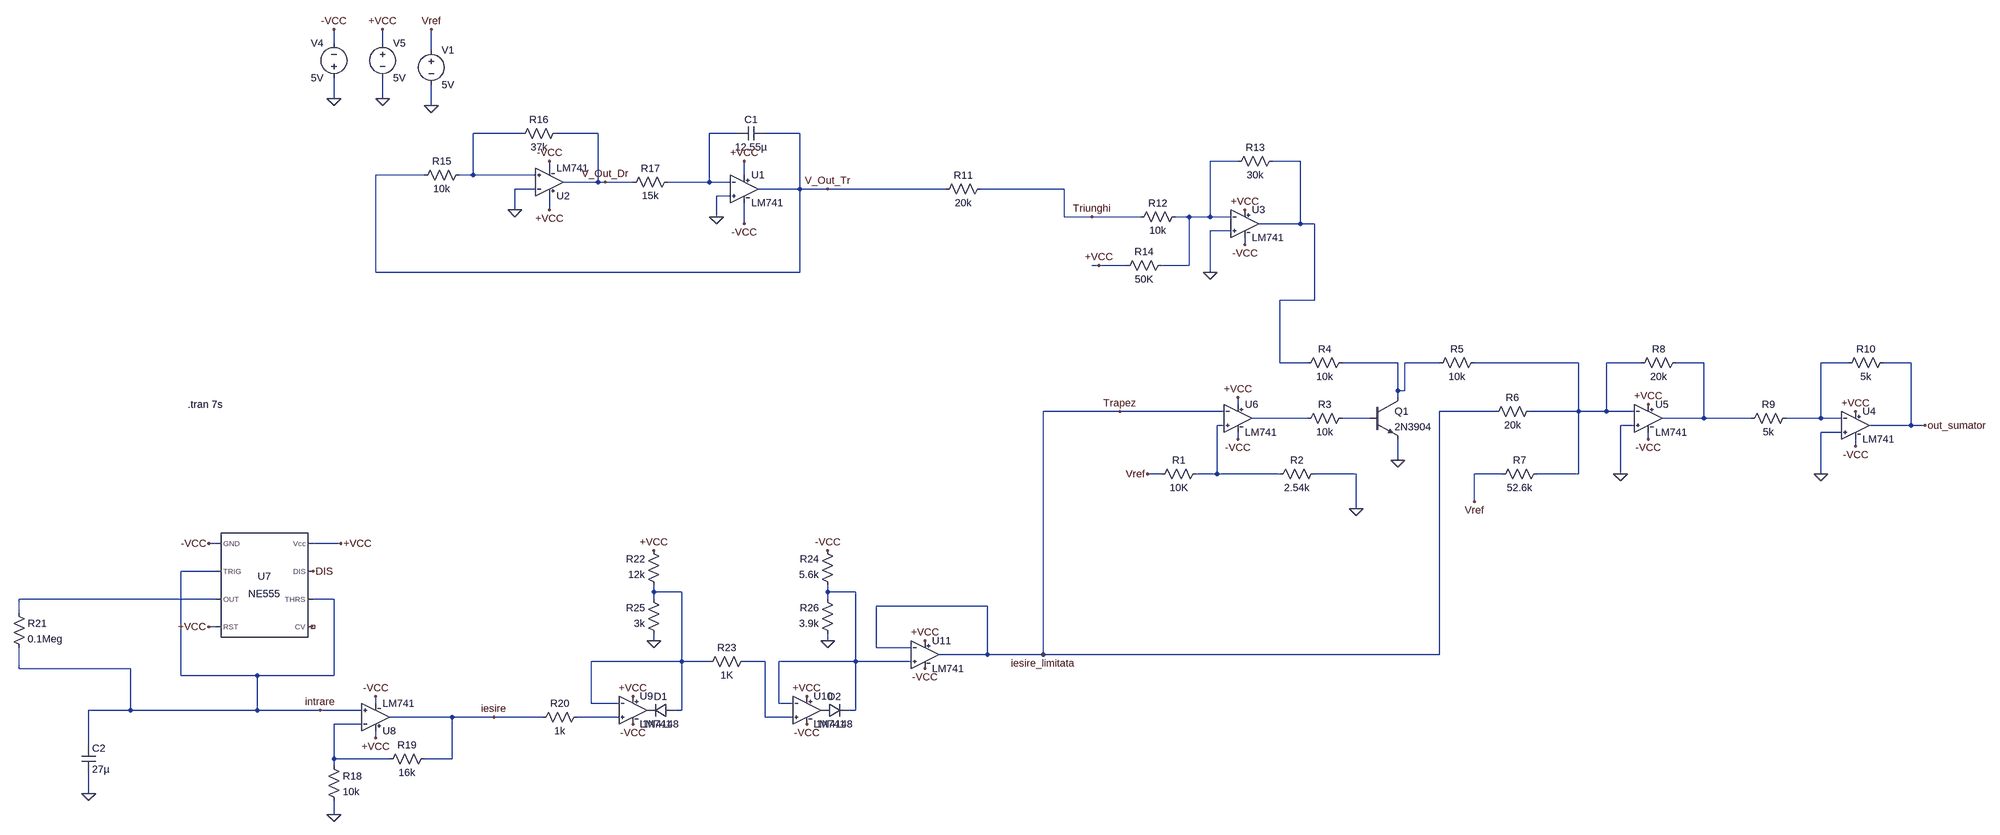
[diagram p0: schematic ProiectSCIAIII_MoldovanBianca_Grupa2231.asc]
ProiectSCIAIII_MoldovanBianca_Grupa2231.asc, the LTspice schematic file:
Version 4.1
SHEET 1 2696 1428
WIRE -2608 -624 -2608 -656
WIRE -2496 -624 -2496 -656
WIRE -2384 -608 -2384 -656
WIRE -2608 -496 -2608 -544
WIRE -2496 -496 -2496 -544
WIRE -2384 -480 -2384 -528
WIRE -2176 -416 -2288 -416
WIRE -2000 -416 -2096 -416
WIRE -1680 -416 -1744 -416
WIRE -1536 -416 -1616 -416
WIRE -528 -352 -592 -352
WIRE -384 -352 -448 -352
WIRE -2112 -336 -2112 -352
WIRE -2400 -320 -2512 -320
WIRE -2288 -320 -2288 -416
WIRE -2288 -320 -2320 -320
WIRE -2144 -320 -2288 -320
WIRE -1664 -320 -1664 -352
WIRE -2000 -304 -2000 -416
WIRE -2000 -304 -2080 -304
WIRE -1984 -304 -2000 -304
WIRE -1920 -304 -1984 -304
WIRE -1744 -304 -1744 -416
WIRE -1744 -304 -1840 -304
WIRE -1696 -304 -1744 -304
WIRE -2144 -288 -2192 -288
WIRE -1536 -288 -1536 -416
WIRE -1536 -288 -1632 -288
WIRE -1472 -288 -1536 -288
WIRE -1200 -288 -1472 -288
WIRE -928 -288 -1120 -288
WIRE -1696 -272 -1728 -272
WIRE -2192 -240 -2192 -288
WIRE -2112 -240 -2112 -272
WIRE -1728 -224 -1728 -272
WIRE -928 -224 -928 -288
WIRE -864 -224 -928 -224
WIRE -752 -224 -864 -224
WIRE -640 -224 -672 -224
WIRE -592 -224 -592 -352
WIRE -592 -224 -640 -224
WIRE -544 -224 -592 -224
WIRE -1664 -208 -1664 -256
WIRE -384 -208 -384 -352
WIRE -384 -208 -480 -208
WIRE -352 -208 -384 -208
WIRE -544 -192 -592 -192
WIRE -512 -160 -512 -176
WIRE -848 -112 -864 -112
WIRE -784 -112 -848 -112
WIRE -640 -112 -640 -224
WIRE -640 -112 -704 -112
WIRE -2512 -96 -2512 -320
WIRE -1536 -96 -1536 -288
WIRE -1536 -96 -2512 -96
WIRE -592 -96 -592 -192
WIRE -352 -32 -352 -208
WIRE -352 -32 -432 -32
WIRE -432 112 -432 -32
WIRE -368 112 -432 112
WIRE -160 112 -288 112
WIRE -64 112 -144 112
WIRE 256 112 16 112
WIRE 400 112 320 112
WIRE 544 112 480 112
WIRE 992 112 928 112
WIRE 1136 112 1072 112
WIRE -160 176 -160 112
WIRE -144 176 -144 112
WIRE -144 176 -160 176
WIRE -160 192 -160 176
WIRE -528 208 -528 192
WIRE -800 224 -976 224
WIRE -560 224 -800 224
WIRE 64 224 -64 224
WIRE 256 224 256 112
WIRE 256 224 144 224
WIRE 320 224 320 112
WIRE 320 224 256 224
WIRE 384 224 320 224
WIRE -368 240 -496 240
WIRE -224 240 -288 240
WIRE 544 240 544 112
WIRE 544 240 448 240
WIRE 768 240 544 240
WIRE 928 240 928 112
WIRE 928 240 848 240
WIRE 976 240 928 240
WIRE -560 256 -576 256
WIRE 384 256 352 256
WIRE 1136 256 1136 112
WIRE 1136 256 1040 256
WIRE 1168 256 1136 256
WIRE 976 272 928 272
WIRE -528 288 -528 272
WIRE 416 288 416 272
WIRE 1008 304 1008 288
WIRE -160 336 -160 288
WIRE -704 368 -736 368
WIRE -576 368 -576 256
WIRE -576 368 -624 368
WIRE -432 368 -576 368
WIRE -256 368 -352 368
WIRE 80 368 16 368
WIRE 256 368 256 224
WIRE 256 368 160 368
WIRE 352 368 352 256
WIRE 928 368 928 272
WIRE 16 432 16 368
WIRE -256 448 -256 368
WIRE -2880 528 -2896 528
WIRE -2592 528 -2656 528
WIRE -2880 592 -2960 592
WIRE -1872 640 -1872 624
WIRE -1808 640 -1872 640
WIRE -1472 640 -1472 624
WIRE -1408 640 -1472 640
WIRE -2880 656 -3344 656
WIRE -2608 656 -2656 656
WIRE -1872 656 -1872 640
WIRE -1472 656 -1472 640
WIRE -1104 672 -1360 672
WIRE -3344 688 -3344 656
WIRE -2880 720 -2896 720
WIRE -1872 752 -1872 736
WIRE -1472 752 -1472 736
WIRE -1360 768 -1360 672
WIRE -1280 768 -1360 768
WIRE -1104 784 -1104 672
WIRE -1104 784 -1216 784
WIRE -976 784 -976 224
WIRE -976 784 -1104 784
WIRE -64 784 -64 224
WIRE -64 784 -976 784
WIRE -1808 800 -1808 640
WIRE -1808 800 -2016 800
WIRE -1744 800 -1808 800
WIRE -1616 800 -1664 800
WIRE -1408 800 -1408 640
WIRE -1408 800 -1584 800
WIRE -1280 800 -1408 800
WIRE -3344 816 -3344 768
WIRE -3088 816 -3344 816
WIRE -2960 832 -2960 592
WIRE -2784 832 -2960 832
WIRE -2608 832 -2608 656
WIRE -2608 832 -2784 832
WIRE -2512 896 -2512 880
WIRE -2016 896 -2016 800
WIRE -1952 896 -2016 896
WIRE -1584 896 -1584 800
WIRE -1552 896 -1584 896
WIRE -3088 912 -3088 816
WIRE -3088 912 -3184 912
WIRE -2784 912 -2784 832
WIRE -2784 912 -3088 912
WIRE -2640 912 -2784 912
WIRE -2544 912 -2640 912
WIRE -1808 912 -1808 800
WIRE -1808 912 -1824 912
WIRE -1408 912 -1408 800
WIRE -1408 912 -1424 912
WIRE -2336 928 -2480 928
WIRE -2240 928 -2336 928
WIRE -2128 928 -2240 928
WIRE -1952 928 -2048 928
WIRE -1616 928 -1616 800
WIRE -1552 928 -1616 928
WIRE -2544 944 -2608 944
WIRE -2512 976 -2512 960
WIRE -3184 992 -3184 912
WIRE -2608 1024 -2608 944
WIRE -2480 1024 -2608 1024
WIRE -2336 1024 -2336 928
WIRE -2336 1024 -2400 1024
WIRE -2608 1040 -2608 1024
WIRE -3184 1104 -3184 1056
WIRE -2608 1152 -2608 1120
FLAG -256 448 0
FLAG -160 336 0
FLAG -528 192 +VCC
FLAG -528 288 -VCC
FLAG 352 368 0
FLAG 928 368 0
FLAG 416 288 -VCC
FLAG 416 208 +VCC
FLAG 1008 224 +VCC
FLAG 1008 304 -VCC
FLAG -736 368 Vref
FLAG -2384 -656 Vref
FLAG -2384 -480 0
FLAG -2608 -496 0
FLAG -2608 -656 -VCC
FLAG -2496 -496 0
FLAG -2496 -656 +VCC
FLAG -800 224 Trapez
FLAG 1168 256 out_sumator
FLAG -592 -96 0
FLAG -512 -240 +VCC
FLAG -512 -160 -VCC
FLAG -848 -112 +VCC
FLAG -2192 -240 0
FLAG -1728 -224 0
FLAG -2112 -240 +VCC
FLAG -2112 -352 -VCC
FLAG -1472 -288 V_Out_Tr
FLAG -1984 -304 V_Out_Dr
FLAG -1664 -208 -VCC
FLAG -1664 -352 +VCC
FLAG -2896 528 -VCC
FLAG -2896 720 +VCC
FLAG -3184 1104 0
FLAG -2592 528 +VCC
FLAG -976 784 iesire_limitata
FLAG -2512 880 -VCC
FLAG -2512 976 +VCC
FLAG -2640 912 intrare
FLAG -2608 1152 0
FLAG -864 -224 Triunghi
FLAG 16 432 Vref
FLAG -1920 880 +VCC
FLAG -1920 944 -VCC
FLAG -1520 880 +VCC
FLAG -1520 944 -VCC
FLAG -1872 752 0
FLAG -1872 544 +VCC
FLAG -1472 752 0
FLAG -1472 544 -VCC
FLAG -2240 928 iesire
FLAG -1248 752 +VCC
FLAG -1248 816 -VCC
FLAG -2656 592 DIS
SYMBOL res -608 352 R90
WINDOW 0 0 56 VBottom 2
WINDOW 3 32 56 VTop 2
SYMATTR InstName R1
SYMATTR Value 10K
SYMBOL res -336 352 R90
WINDOW 0 0 56 VBottom 2
WINDOW 3 32 56 VTop 2
SYMATTR InstName R2
SYMATTR Value 2.54k
SYMBOL res -272 224 R90
WINDOW 0 0 56 VBottom 2
WINDOW 3 32 56 VTop 2
SYMATTR InstName R3
SYMATTR Value 10k
SYMBOL res -272 96 R90
WINDOW 0 0 56 VBottom 2
WINDOW 3 32 56 VTop 2
SYMATTR InstName R4
SYMATTR Value 10k
SYMBOL npn -224 192 R0
SYMATTR InstName Q1
SYMATTR Value 2N3904
SYMBOL res -80 128 R270
WINDOW 0 32 56 VTop 2
WINDOW 3 0 56 VBottom 2
SYMATTR InstName R5
SYMATTR Value 10k
SYMBOL res 48 240 R270
WINDOW 0 32 56 VTop 2
WINDOW 3 0 56 VBottom 2
SYMATTR InstName R6
SYMATTR Value 20k
SYMBOL res 64 384 R270
WINDOW 0 32 56 VTop 2
WINDOW 3 0 56 VBottom 2
SYMATTR InstName R7
SYMATTR Value 52.6k
SYMBOL res 496 96 R90
WINDOW 0 0 56 VBottom 2
WINDOW 3 32 56 VTop 2
SYMATTR InstName R8
SYMATTR Value 20k
SYMBOL res 864 224 R90
WINDOW 0 0 56 VBottom 2
WINDOW 3 32 56 VTop 2
SYMATTR InstName R9
SYMATTR Value 5k
SYMBOL res 1088 96 R90
WINDOW 0 0 56 VBottom 2
WINDOW 3 32 56 VTop 2
SYMATTR InstName R10
SYMATTR Value 5k
SYMBOL voltage -2384 -624 R0
SYMATTR InstName V1
SYMATTR Value 5V
SYMBOL voltage -2608 -528 R180
WINDOW 0 24 96 Left 2
WINDOW 3 24 16 Left 2
SYMATTR InstName V4
SYMATTR Value 5V
SYMBOL voltage -2496 -640 R0
SYMATTR InstName V5
SYMATTR Value 5V
SYMBOL res -656 -240 R90
WINDOW 0 0 56 VBottom 2
WINDOW 3 32 56 VTop 2
SYMATTR InstName R12
SYMATTR Value 10k
SYMBOL res -432 -368 R90
WINDOW 0 0 56 VBottom 2
WINDOW 3 32 56 VTop 2
SYMATTR InstName R13
SYMATTR Value 30k
SYMBOL res -688 -128 R90
WINDOW 0 0 56 VBottom 2
WINDOW 3 32 56 VTop 2
SYMATTR InstName R14
SYMATTR Value 50K
SYMBOL res -2304 -336 R90
WINDOW 0 0 56 VBottom 2
WINDOW 3 32 56 VTop 2
SYMATTR InstName R15
SYMATTR Value 10k
SYMBOL res -2080 -432 R90
WINDOW 0 0 56 VBottom 2
WINDOW 3 32 56 VTop 2
SYMATTR InstName R16
SYMATTR Value 37k
SYMBOL res -1824 -320 R90
WINDOW 0 0 56 VBottom 2
WINDOW 3 32 56 VTop 2
SYMATTR InstName R17
SYMATTR Value 15k
SYMBOL cap -1616 -432 R90
WINDOW 0 0 32 VBottom 2
WINDOW 3 32 32 VTop 2
SYMATTR InstName C1
SYMATTR Value 12.55µ
SYMBOL Misc\\NE555 -2768 624 R0
SYMATTR InstName U7
SYMBOL cap -3200 992 R0
SYMATTR InstName C2
SYMATTR Value 27µ
SYMBOL res -2624 1024 R0
SYMATTR InstName R18
SYMATTR Value 10k
SYMBOL res -2384 1008 R90
WINDOW 0 0 56 VBottom 2
WINDOW 3 32 56 VTop 2
SYMATTR InstName R19
SYMATTR Value 16k
SYMBOL res -2144 944 R270
WINDOW 0 32 56 VTop 2
WINDOW 3 0 56 VBottom 2
SYMATTR InstName R20
SYMATTR Value 1k
SYMBOL res -3360 672 R0
SYMATTR InstName R21
SYMATTR Value 0.1Meg
SYMBOL res -1104 -304 R90
WINDOW 0 0 56 VBottom 2
WINDOW 3 32 56 VTop 2
SYMATTR InstName R11
SYMATTR Value 20k
SYMBOL LM741 -1664 -352 R0
SYMATTR InstName U1
SYMBOL LM741 -2112 -240 M180
SYMATTR InstName U2
SYMBOL LM741 -512 -272 R0
SYMATTR InstName U3
SYMBOL LM741 1008 192 R0
SYMATTR InstName U4
SYMBOL LM741 416 176 R0
SYMATTR InstName U5
SYMBOL LM741 -528 176 R0
SYMATTR InstName U6
SYMBOL LM741 -2512 992 M180
SYMATTR InstName U8
SYMBOL LM741 -1920 848 R0
SYMATTR InstName U9
SYMBOL diode -1824 896 R90
WINDOW 0 0 32 VBottom 2
WINDOW 3 32 32 VTop 2
SYMATTR InstName D1
SYMATTR Value 1N4148
SYMBOL LM741 -1520 848 R0
SYMATTR InstName U10
SYMBOL diode -1488 928 R270
WINDOW 0 32 32 VTop 2
WINDOW 3 0 32 VBottom 2
SYMATTR InstName D2
SYMATTR Value 1N4148
SYMBOL res -1856 640 R180
WINDOW 0 36 76 Left 2
WINDOW 3 36 40 Left 2
SYMATTR InstName R22
SYMATTR Value 12k
SYMBOL res -1648 784 R90
WINDOW 0 0 56 VBottom 2
WINDOW 3 32 56 VTop 2
SYMATTR InstName R23
SYMATTR Value 1K
SYMBOL res -1856 752 R180
WINDOW 0 36 76 Left 2
WINDOW 3 36 40 Left 2
SYMATTR InstName R25
SYMATTR Value 3k
SYMBOL res -1456 640 R180
WINDOW 0 36 76 Left 2
WINDOW 3 36 40 Left 2
SYMATTR InstName R24
SYMATTR Value 5.6k
SYMBOL res -1456 752 R180
WINDOW 0 36 76 Left 2
WINDOW 3 36 40 Left 2
SYMATTR InstName R26
SYMATTR Value 3.9k
SYMBOL LM741 -1248 720 R0
SYMATTR InstName U11
TEXT -2944 208 Left 2 !.tran 7s

The netlist it stands for:
* ProiectSCIAIII_MoldovanBianca_Grupa2231.asc
R1 N011 Vref 10K
R2 0 N011 2.54k
R3 N010 N009 10k
R4 N005 N004 10k
Q1 N005 N010 0 0 2N3904
R5 N005 N006 10k
R6 iesire_limitata N006 20k
R7 Vref N006 52.6k
R8 N007 N006 20k
R9 N008 N007 5k
R10 out_sumator N008 5k
V1 Vref 0 5V
V4 0 -VCC 5V
V5 +VCC 0 5V
R12 N003 Triunghi 10k
R13 N004 N003 30k
R14 N003 +VCC 50K
R15 N001 V_Out_Tr 10k
R16 V_Out_Dr N001 37k
R17 N002 V_Out_Dr 15k
C1 V_Out_Tr N002 12.55µ
X§U7 -VCC intrare N014 +VCC NC_01 intrare DIS +VCC NE555  ; pins GND TRIG OUT RST CV THRS DIS Vcc
C2 intrare 0 27µ
R18 N017 0 10k
R19 iesire N017 16k
R20 iesire N016 1k
R21 N014 intrare 0.1Meg
R11 Triunghi V_Out_Tr 20k
X§U1 0 N002 +VCC -VCC V_Out_Tr LM741  ; pins In+ In- V+ V- OUT
X§U2 N001 0 +VCC -VCC V_Out_Dr LM741  ; pins In+ In- V+ V- OUT
X§U3 0 N003 +VCC -VCC N004 LM741  ; pins In+ In- V+ V- OUT
X§U4 0 N008 +VCC -VCC out_sumator LM741  ; pins In+ In- V+ V- OUT
X§U5 0 N006 +VCC -VCC N007 LM741  ; pins In+ In- V+ V- OUT
X§U6 N011 iesire_limitata +VCC -VCC N009 LM741  ; pins In+ In- V+ V- OUT
X§U8 intrare N017 +VCC -VCC iesire LM741  ; pins In+ In- V+ V- OUT
X§U9 N016 N012 +VCC -VCC P001 LM741  ; pins In+ In- V+ V- OUT
D1 N012 P001 1N4148
X§U10 N015 N013 +VCC -VCC P002 LM741  ; pins In+ In- V+ V- OUT
D2 P002 N013 1N4148
R22 N012 +VCC 12k
R23 N015 N012 1K
R25 0 N012 3k
R24 N013 -VCC 5.6k
R26 0 N013 3.9k
X§U11 N013 iesire_limitata +VCC -VCC iesire_limitata LM741  ; pins In+ In- V+ V- OUT
.model D D
.lib standard.dio
.model NPN NPN
.model PNP PNP
.lib standard.bjt
.tran 7s
.lib NE555.sub
.lib LM741.lib
.backanno
.end